# Altium schematic sheet Anybus-Base.SchDoc
size A4
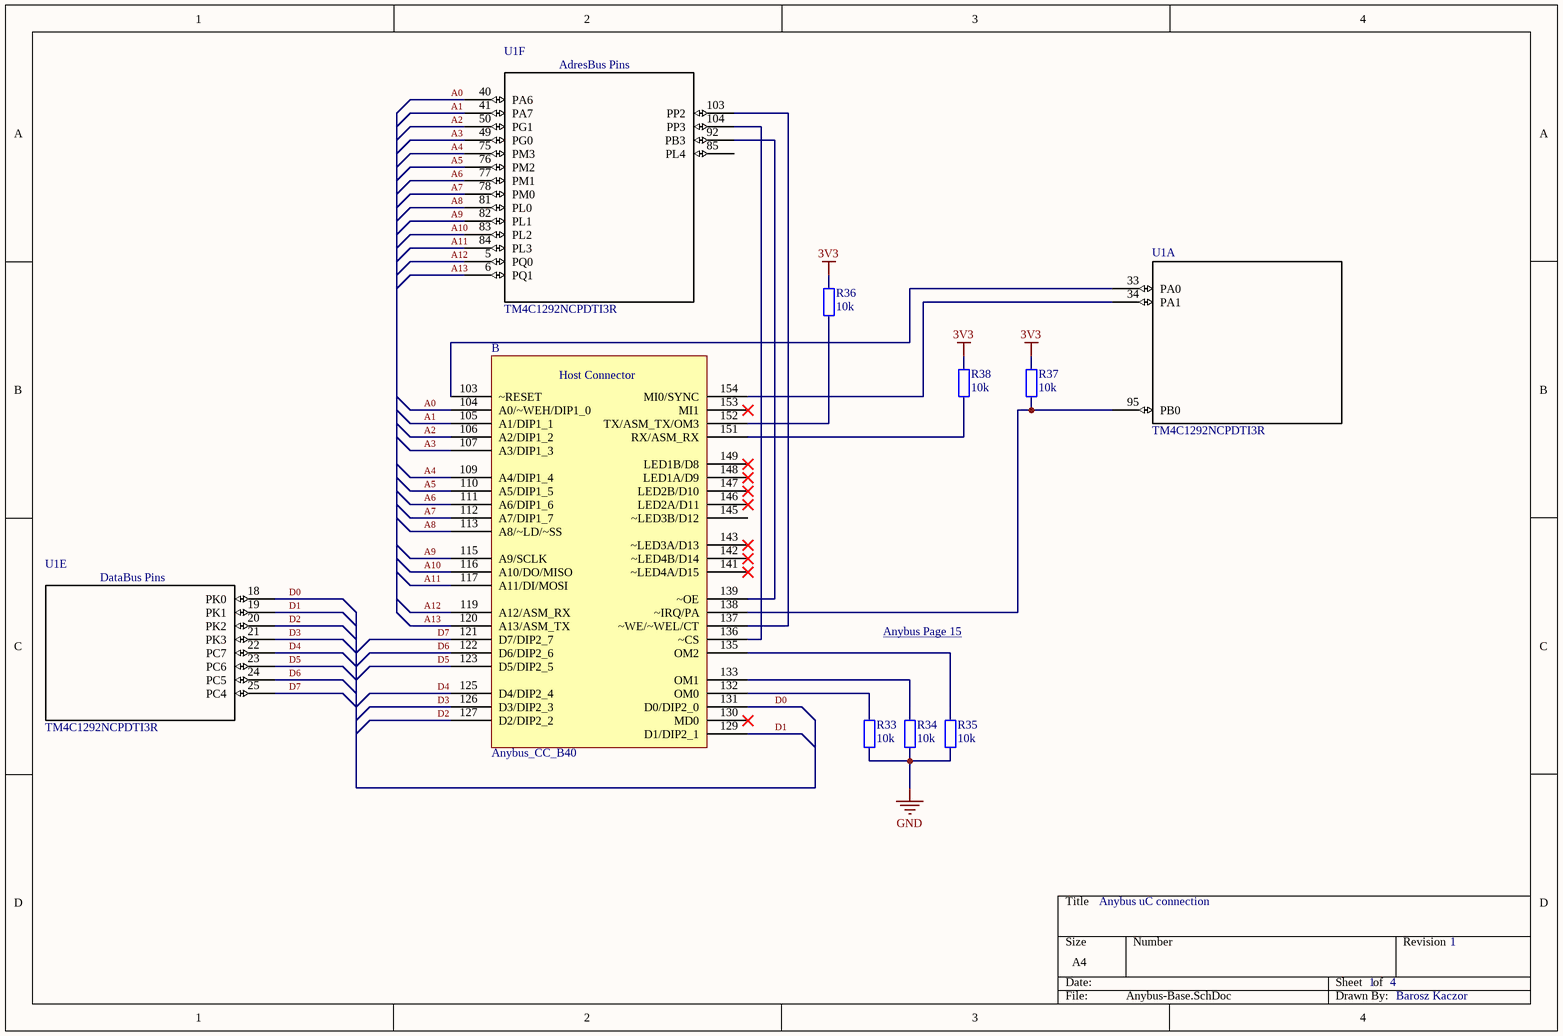
[diagram p0: Anybus-Base.SchDoc]

## Parts
?  Anybus_CC_B40  [Anybus-CC-B40]  (part B of 3)
R33  10k  [0603_R HighDensity]
R34  10k  [0603_R HighDensity]
R35  10k  [0603_R HighDensity]
R36  10k  [RES0603_M]
R37  10k  [RES0603_M]
R38  10k  [RES0603_M]
U1  TM4C1292NCPDTI3R  [PDT0128A_N]  (parts A,E,F of 7)

## Nets
3V3: R36.2 R37.2 R38.2
GND: R33.1 R34.1 R35.1
A0: ?.104(A0/~WEH/DIP1_0) U1.40(PA6)
A1: ?.105(A1/DIP1_1) U1.41(PA7)
A2: ?.106(A2/DIP1_2) U1.50(PG1)
A3: ?.107(A3/DIP1_3) U1.49(PG0)
A4: ?.109(A4/DIP1_4) U1.75(PM3)
A5: ?.110(A5/DIP1_5) U1.76(PM2)
A6: ?.111(A6/DIP1_6) U1.77(PM1)
A7: ?.112(A7/DIP1_7) U1.78(PM0)
A8: ?.113(A8/~LD/~SS) U1.81(PL0)
A9: ?.115(A9/SCLK) U1.82(PL1)
A10: ?.116(A10/DO/MISO) U1.83(PL2)
A11: ?.117(A11/DI/MOSI) U1.84(PL3)
A12: ?.119(A12/ASM_RX) U1.5(PQ0)
A13: ?.120(A13/ASM_TX) U1.6(PQ1)
D0: ?.131(D0/DIP2_0) U1.18(PK0)
D1: ?.129(D1/DIP2_1) U1.19(PK1)
D2: ?.127(D2/DIP2_2) U1.20(PK2)
D3: ?.126(D3/DIP2_3) U1.21(PK3)
D4: ?.125(D4/DIP2_4) U1.22(PC7)
D5: ?.123(D5/DIP2_5) U1.23(PC6)
D6: ?.122(D6/DIP2_6) U1.24(PC5)
D7: ?.121(D7/DIP2_7) U1.25(PC4)
Net?_103: ?.103(~RESET) U1.33(PA0)
Net?_132: ?.132(OM0) R33.2
Net?_133: ?.133(OM1) R34.2
Net?_135: ?.135(OM2) R35.2
Net?_136: ?.136(~CS) U1.104(PP3)
Net?_137: ?.137(~WE/~WEL/CT) U1.103(PP2)
Net?_138: ?.138(~IRQ/PA) R37.1 U1.95(PB0)
Net?_139: ?.139(~OE) U1.92(PB3)
Net?_151: ?.151(RX/ASM_RX) R38.1
Net?_152: ?.152(TX/ASM_TX/OM3) R36.1
Net?_154: ?.154(MI0/SYNC) U1.34(PA1)

Not connected (* = marked no-connect by the designer): ? 130(MD0)* 141(~LED4A/D15)* 142(~LED4B/D14)* 143(~LED3A/D13)* 145(~LED3B/D12) 146(LED2A/D11)* 147(LED2B/D10)* 148(LED1A/D9)* 149(LED1B/D8)* 153(MI1)*; U1 85(PL4)

## Notes on the sheet
- Anybus Page 15 <http://www.anybus.com/upload/Anybus-CompactCom%20B40%20Brick-2237-Anybus%20CompactCom%20M40%20Hardware%20Design%20Guide.pdf>
- Anybus uC connection
- 1     4
- 1
- Barosz Kaczor
- (in symbol Anybus_CC_B40, part B) Host Connector
- (in symbol TM4C1292NCPDTI3R, part E) DataBus Pins
- (in symbol TM4C1292NCPDTI3R, part F) AdresBus Pins

## Library data of the parts
R33-R38 = R: Resistor
U1 = TM4C1292NCPDTI3R: Imported; Manufacturer: Texas Instruments; CompType: IC; PIN_COUNT: 128; Application_BuildNumber: *; PartNumber: TM4C1292NCPDTI3R; Alternate PartNumber: TM4C1292NCPDTI3; PackageReference: PDT0128A; MountType: SMT; RoHS: Y; RefDes: RefDes; Type: DEV; Value: Value